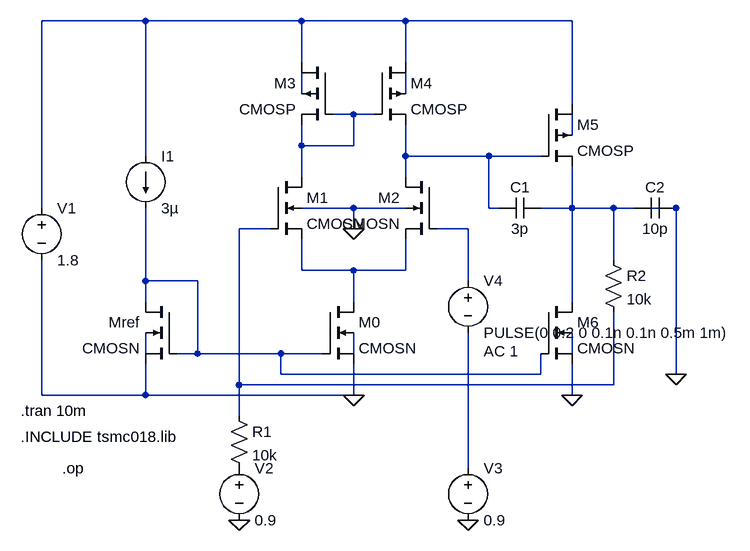
[diagram p0: schematic OTA[1].asc]
OTA[1].asc, the LTspice schematic file:
Version 4
SHEET 1 1180 680
WIRE 96 -192 -64 -192
WIRE 336 -192 96 -192
WIRE 496 -192 336 -192
WIRE 752 -192 496 -192
WIRE 336 -128 336 -192
WIRE 496 -128 496 -192
WIRE 336 -80 336 -112
WIRE 496 -80 496 -112
WIRE 752 -64 752 -192
WIRE 416 -48 384 -48
WIRE 448 -48 416 -48
WIRE 752 -16 752 -48
WIRE 336 0 336 -32
WIRE 416 0 416 -48
WIRE 416 0 336 0
WIRE 96 16 96 -192
WIRE 496 16 496 -32
WIRE 624 16 496 16
WIRE 704 16 624 16
WIRE 336 48 336 0
WIRE 496 48 496 16
WIRE -64 96 -64 -192
WIRE 416 96 336 96
WIRE 496 96 416 96
WIRE 624 96 624 16
WIRE 640 96 624 96
WIRE 752 96 752 32
WIRE 752 96 704 96
WIRE 816 96 752 96
WIRE 848 96 816 96
WIRE 912 96 864 96
WIRE 288 128 240 128
WIRE 416 128 416 96
WIRE 592 128 544 128
WIRE 816 176 816 96
WIRE 336 192 336 144
WIRE 416 192 336 192
WIRE 496 192 496 144
WIRE 496 192 416 192
WIRE 96 208 96 96
WIRE 176 208 96 208
WIRE 592 208 592 128
WIRE 96 240 96 208
WIRE 416 240 416 192
WIRE 752 240 752 96
WIRE 96 320 96 288
WIRE 176 320 176 208
WIRE 176 320 144 320
WIRE 304 320 176 320
WIRE 368 320 304 320
WIRE 416 320 416 288
WIRE 752 320 752 288
WIRE 304 352 304 320
WIRE 704 352 704 320
WIRE 704 352 304 352
WIRE 912 352 912 96
WIRE 240 368 240 128
WIRE 816 368 816 256
WIRE 816 368 240 368
WIRE -64 384 -64 176
WIRE 96 384 96 336
WIRE 96 384 -64 384
WIRE 416 384 416 336
WIRE 416 384 96 384
WIRE 752 384 752 336
WIRE 240 416 240 368
WIRE 592 496 592 288
FLAG 416 128 0
FLAG 416 384 0
FLAG 752 384 0
FLAG 912 352 0
FLAG 592 576 0
FLAG 240 576 0
SYMBOL cmosn 144 240 M0
SYMATTR InstName Mref
SYMATTR Value2 l=0.18u w=5u
SYMBOL current 96 16 R0
WINDOW 123 0 0 Left 2
WINDOW 39 0 0 Left 2
SYMATTR InstName I1
SYMATTR Value 3µ
SYMBOL voltage -64 80 R0
WINDOW 123 0 0 Left 2
WINDOW 39 0 0 Left 2
SYMATTR InstName V1
SYMATTR Value 1.8
SYMBOL cmosn 368 240 R0
SYMATTR InstName M0
SYMATTR Value2 l=0.18u w=8u
SYMBOL cmosn 288 48 R0
SYMATTR InstName M1
SYMATTR Value2 l=0.18u w=1.8u
SYMBOL cmosn 544 48 M0
SYMATTR InstName M2
SYMATTR Value2 l=0.18u w=1.8u
SYMBOL cmosp 384 -128 M0
SYMATTR InstName M3
SYMATTR Value2 l=0.18u w=2.2u
SYMBOL cmosp 448 -128 R0
SYMATTR InstName M4
SYMATTR Value2 l=0.18u w=2.2u
SYMBOL voltage 240 480 R0
WINDOW 123 0 0 Left 2
WINDOW 39 0 0 Left 2
SYMATTR InstName V2
SYMATTR Value 0.9
SYMBOL voltage 592 480 R0
WINDOW 123 0 0 Left 2
WINDOW 39 0 0 Left 2
SYMATTR InstName V3
SYMATTR Value 0.9
SYMBOL cmosp 704 -64 R0
SYMATTR InstName M5
SYMATTR Value2 l=0.18u w=25u
SYMBOL cmosn 704 240 R0
SYMATTR InstName M6
SYMATTR Value2 l=0.18u w=23u
SYMBOL voltage 592 192 R0
WINDOW 123 24 124 Left 2
WINDOW 39 0 0 Left 2
SYMATTR Value2 AC 1
SYMATTR InstName V4
SYMATTR Value PULSE(0 0.2 0 0.1n 0.1n 0.5m 1m)
SYMBOL cap 704 80 R90
WINDOW 0 0 32 VBottom 2
WINDOW 3 32 32 VTop 2
SYMATTR InstName C1
SYMATTR Value 3p
SYMBOL cap 912 80 R90
WINDOW 0 0 32 VBottom 2
WINDOW 3 32 32 VTop 2
SYMATTR InstName C2
SYMATTR Value 10p
SYMBOL res 800 160 R0
SYMATTR InstName R2
SYMATTR Value 10k
SYMBOL res 224 400 R0
SYMATTR InstName R1
SYMATTR Value 10k
TEXT -96 408 Left 2 !.tran 10m
TEXT -96 448 Left 2 !.INCLUDE tsmc018.lib
TEXT -32 496 Left 2 !.op

The netlist it stands for:
* OTA[1].asc
Mref N011 N011 0 N012 CMOSN l=0.18u w=5u
I1 N001 N011 3µ
V1 N001 0 1.8
M0 N010 N011 0 N013 CMOSN l=0.18u w=8u
M1 N004 N008 N010 0 CMOSN l=0.18u w=1.8u
M2 N006 N009 N010 0 CMOSN l=0.18u w=1.8u
M3 N001 N004 N004 N002 CMOSP l=0.18u w=2.2u
M4 N001 N004 N006 N003 CMOSP l=0.18u w=2.2u
V2 P001 0 0.9
V3 N015 0 0.9
M5 N001 N006 N007 N005 CMOSP l=0.18u w=25u
M6 N007 N011 0 N014 CMOSN l=0.18u w=23u
V4 N009 N015 PULSE(0 0.2 0 0.1n 0.1n 0.5m 1m) AC 1
C1 N007 N006 3p
C2 0 N007 10p
R2 N007 N008 10k
R1 N008 P001 10k
.model NMOS NMOS
.model PMOS PMOS
.lib standard.mos
.tran 10m
.INCLUDE tsmc018.lib
.op
.backanno
.end